# EAGLE design Kobold -- ATtiny85 and DRV8830 Combo -- v07 (EAGLE 6.5.0)
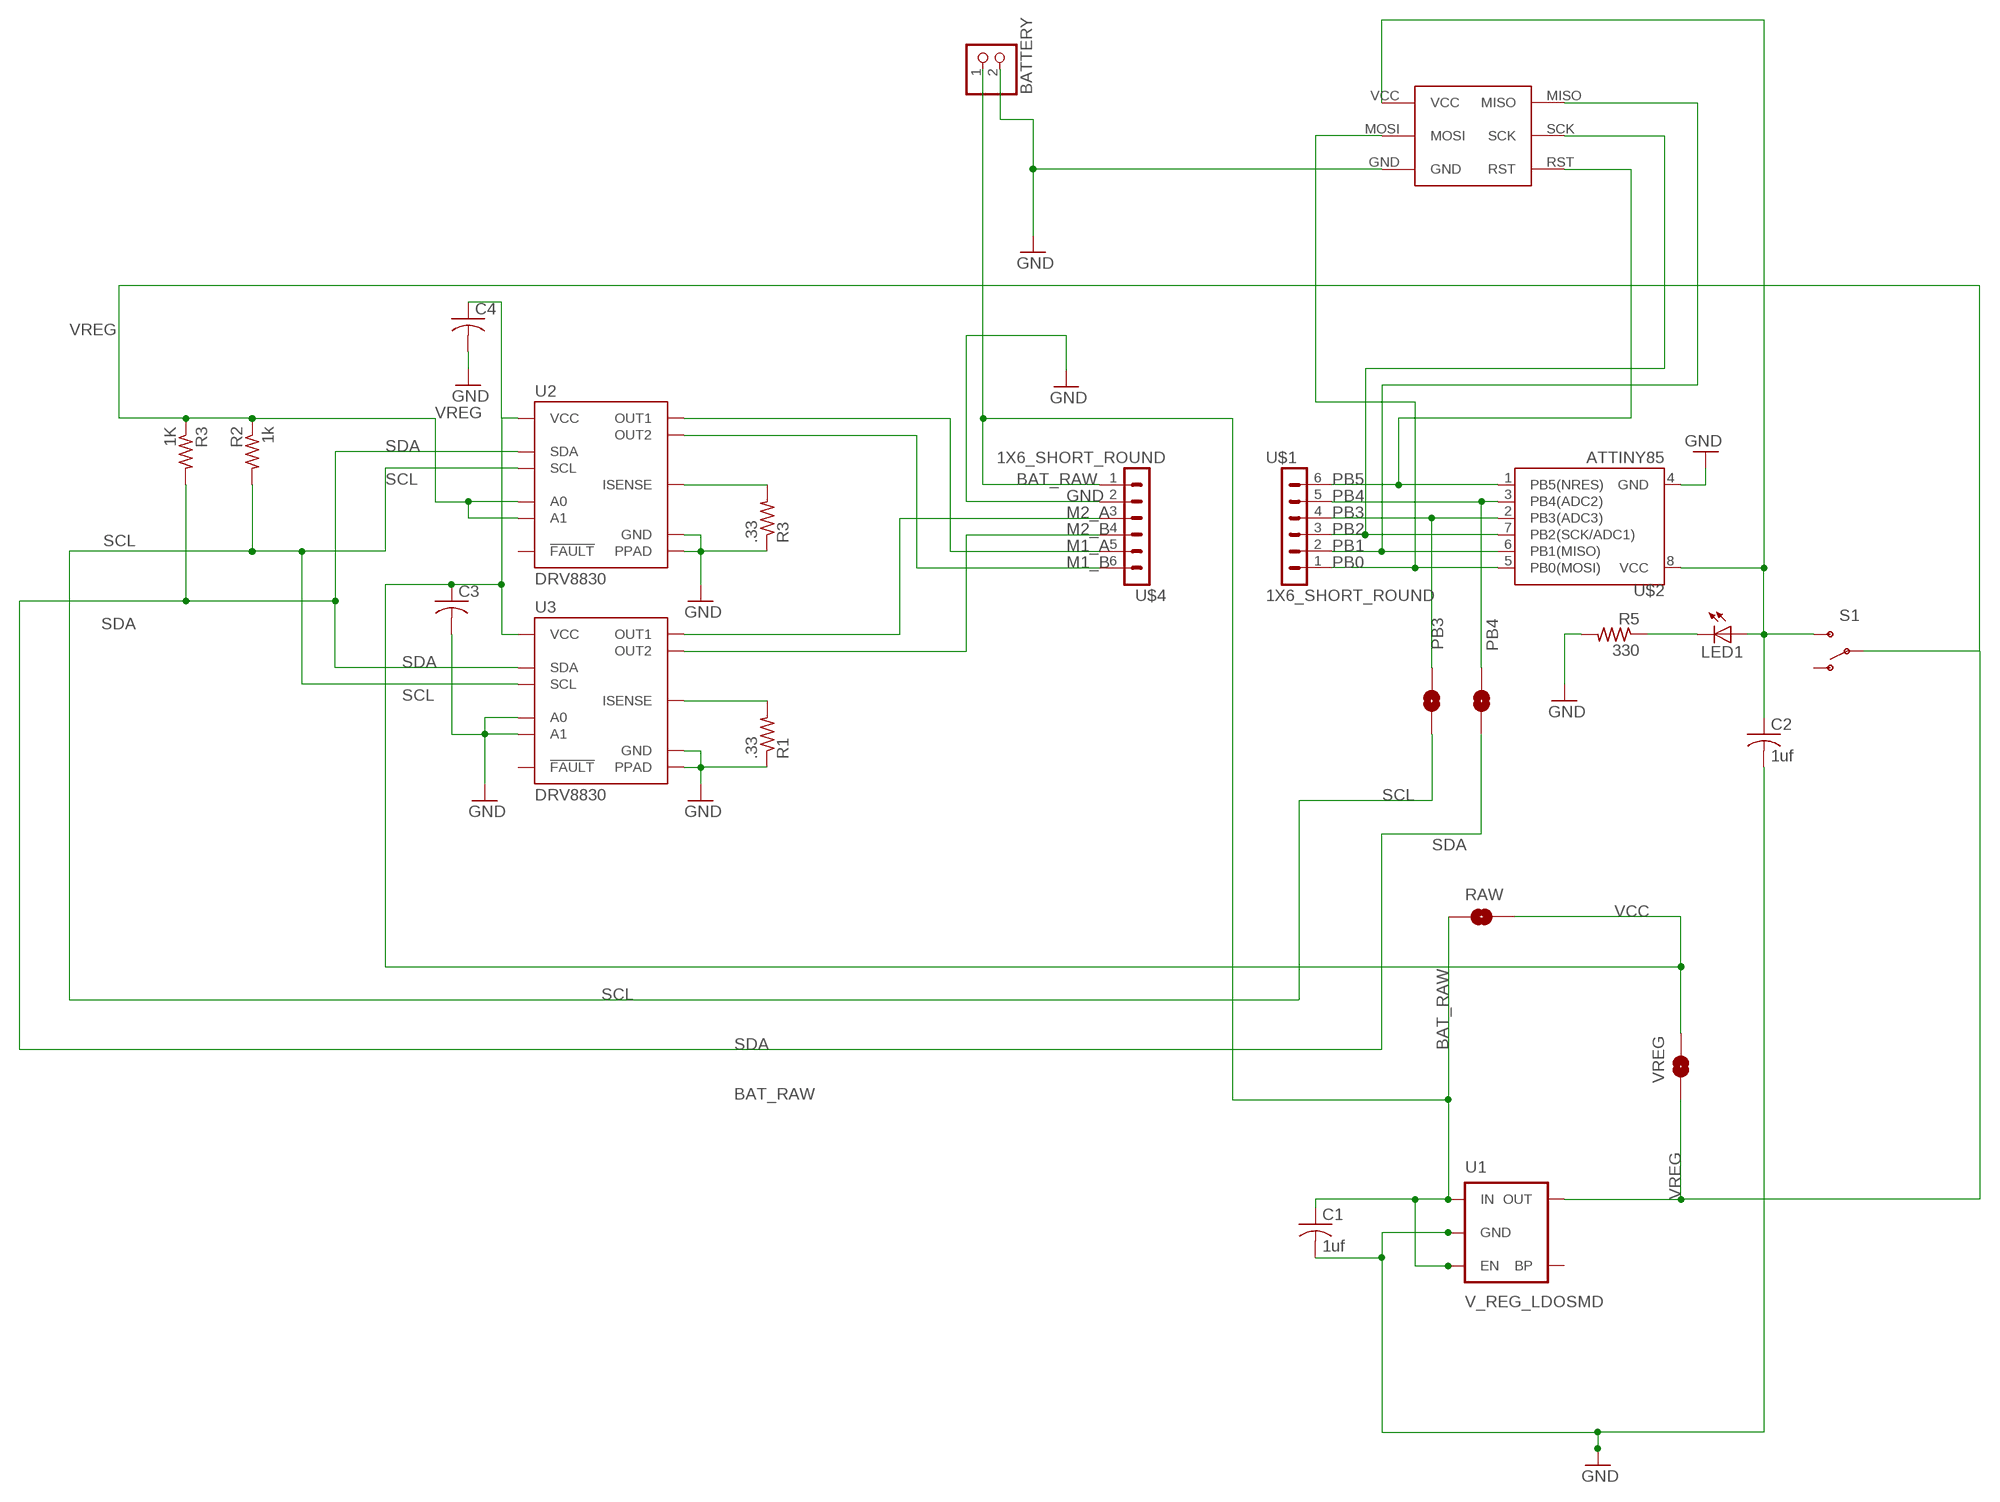
[diagram p0: schematic, sheet 1]

## Parts
1K  R3  R-US_R0402  [R0402]
BATTERY  JST_2PIN-THM  [JST-PH-2-THM]
C1  1uf  C-USC0402  [C0402]
C2  1uf  C-USC0402  [C0402]
C3  C-USC0402  [C0402]
C4  C-USC0402  [C0402]
LED1  LEDCHIP-LED0603  [CHIP-LED0603]
R1  .33  R-US_R0402  [R0402]
R2  1k  R-US_R0402  [R0402]
R3  .33  R-US_R0402  [R0402]
R5  330  R-US_R0402  [R0402]
RAW  SOLDERJUMPERNO  [SJ_2S-NO]
S1  SWITCH-SPDT-SMD-A  [SWITCH-SPST-SMD-A]
SJ6  SOLDERJUMPERNO  [SJ_2S-NO]
SJ7  SOLDERJUMPERNO  [SJ_2S-NO]
U1  V_REG_LDOSMD  [SOT23-5]
U2  DRV8830  [MSOP-10-GNDPAD]
U3  DRV8830  [MSOP-10-GNDPAD]
U$1  1X6_SHORT_ROUND  [1X6_SHORT_ROUND]
U$2  ATTINY85  ATTINY45  [SO08-EIAJ]
U$4  1X6_SHORT_ROUND  [1X6_SHORT_ROUND]
U$5  POGO_PIN_SPI_PAD  [POGO_PIN_SPI_PAD]
VREG  SOLDERJUMPERNO  [SJ_2S-NO]

## Nets
BAT_RAW: BATTERY.1 C1.1 RAW.1 U1.1(IN) U1.3(EN) U$4.1
GND: BATTERY.2 C1.2 C2.2 C3.2 C4.2 R1.1 R3.1 R5.2 U1.2(GND) U2.5(GND) U2.GND(PPAD) U3.5(GND) U3.7(A0) U3.8(A1) U3.GND(PPAD) U$2.4(GND) U$4.2 U$5.GND
M1_A: U2.3(OUT1) U$4.5
M1_B: U2.1(OUT2) U$4.6
M2_A: U3.3(OUT1) U$4.3
M2_B: U3.1(OUT2) U$4.4
N$1: R1.2 U3.2(ISENSE)
N$2: R3.2 U2.2(ISENSE)
N$3: LED1.C R5.1
PB0: U$1.1 U$2.5(PB0(MOSI)) U$5.MOSI
PB1: U$1.2 U$2.6(PB1(MISO)) U$5.MISO
PB2: U$1.3 U$2.7(PB2(SCK/ADC1)) U$5.SCK
PB3: SJ7.2 U$1.4 U$2.2(PB3(ADC3))
PB4: SJ6.2 U$1.5 U$2.3(PB4(ADC2))
PB5: U$1.6 U$2.1(PB5(NRES)) U$5.RST
PP_VCC: C2.1 LED1.A S1.3(S) U$2.8(VCC) U$5.VCC
SCL: R2.2 SJ7.1 U2.10(SCL) U3.10(SCL)
SDA: 1K.2 SJ6.1 U2.9(SDA) U3.9(SDA)
VCC: C3.1 C4.1 RAW.2 U2.4(VCC) U3.4(VCC) VREG.2
VREG: 1K.1 R2.1 S1.2(P) U1.5(OUT) U2.7(A0) U2.8(A1) VREG.1
Unconnected: S1.1(O) U1.4(BP) U2.6(!FAULT) U3.6(!FAULT)

## Library data of the parts
1K R1-R3 R5 = resistor:R-US_: RESISTOR, American symbol
BATTERY = adafruit:JST_2PIN: JST 2-Pin Connectors of various flavors SMT-RA (S2B-PH-SM4) 4UConnector #17311 SMT (B2B-PH-SM4) THM-RA (S2B-PH) THM (B2B-PH)
C1-C4 = resistor:C-US: CAPACITOR, American symbol
LED1 = led:LED: LED OSRAM: - CHIPLED LG R971, LG N971, LY N971, LG Q971, LY Q971, LO R971, LY R971 LH N974, LH R974 LS Q976, LO Q976, LY Q976 LO Q996 - Hyper CHIPLED LW Q18S LB Q993, LB Q99A, LB R99A - SideLED LS A670, LO A670, LY A670, LG A670, LP A670 LB A673, LV A673, LT A673, LW A673 LH A674 LY A675 LS A676, LA A676, LO A676, LY A676, LW A676 LS A679, LY A679, LG A679 - Hyper Micro SIDELED® LS Y876, LA Y876, LO Y876, LY Y876 LT Y87S - SmartLED LW L88C, LW L88S LB L89C, LB L89S, LG L890 LS L89K, LO L89K, LY L89K LS L896, LA L896, LO L896, LY L896 - TOPLED LS T670, LO T670, LY T670, LG T670, LP T670 LSG T670, LSP T670, LSY T670, LOP T670, LYG T670 LG T671, LOG T671, LSG T671 LB T673, LV T673, LT T673, LW T673 LH T674 LS T676, LA T676, LO T676, LY T676, LB T676, LH T676, LSB T676, LW T676 LB T67C, LV T67C, LT T67C, LS T67K, LO T67K, LY T67K, LW E67C LS E67B, LA E67B, LO E67B, LY E67B, LB E67C, LV E67C, LT E67C LW T67C LS T679, LY T679, LG T679 LS T770, LO T770, LY T770, LG T770, LP T770 LB T773, LV T773, LT T773, LW T773 LH T774 LS E675, LA E675, LY E675, LS T675 LS T776, LA T776, LO T776, LY T776, LB T776 LHGB T686 LT T68C, LB T68C - Hyper Mini TOPLED® LB M676 - Mini TOPLED Santana® LG M470 LS M47K, LO M47K, LY M47K Source: http://www.osram.convergy.de LUXEON: - LUMILED® LXK2-PW12-R00, LXK2-PW12-S00, LXK2-PW14-U00, LXK2-PW14-V00 LXK2-PM12-R00, LXK2-PM12-S00, LXK2-PM14-U00 LXK2-PE12-Q00, LXK2-PE12-R00, LXK2-PE12-S00, LXK2-PE14-T00, LXK2-PE14-U00 LXK2-PB12-K00, LXK2-PB12-L00, LXK2-PB12-M00, LXK2-PB14-N00, LXK2-PB14-P00, LXK2-PB14-Q00 LXK2-PR12-L00, LXK2-PR12-M00, LXK2-PR14-Q00, LXK2-PR14-R00 LXK2-PD12-Q00, LXK2-PD12-R00, LXK2-PD12-S00 LXK2-PH12-R00, LXK2-PH12-S00 LXK2-PL12-P00, LXK2-PL12-Q00, LXK2-PL12-R00 Source: www.luxeon.com KINGBRIGHT: KA-3528ASYC Source: www.kingbright.com
RAW SJ6 SJ7 VREG = SparkFun:SOLDERJUMPER: Solder Jumper Standard SMD solder jumper. Used to automate production. Two varients : Normally Open and Normally Closed are the same, but have different paste layers. NC will have a large amount of paste and should jumper during reflow.
S1 = SparkFun-Electromechanical:SWITCH-SPDT: SPDT Switch Simple slide switch, Spark Fun Electronics SKU : COM-00102 DPDT SMT slide switch, AYZ0202, SWCH-08179
U1 = SparkFun:V_REG_LDO: Voltage Regulator LDO Standard 150mA LDO voltage regulator in SOT-23 layout. Micrel part MIC5205. BP (by-pass) pin is used to lower output noise with 470pF cap.
U2 U3 = SparkFun-PowerIC:DRV8830: DRV8830 I2C DC Motor Driver TSSOP-10 with exposed power pad 1A current limit, 2.75V to 6.8V; PROD_ID: IC-11646
U$1 U$4 = Random parts(01-14-14):1X6_SHORT_ROUND
U$2 = SparkFun:ATTINY45: Atmel ATTiny45
U$5 = Random parts(01-14-14):POGO_PIN_SPI_PAD

## Board
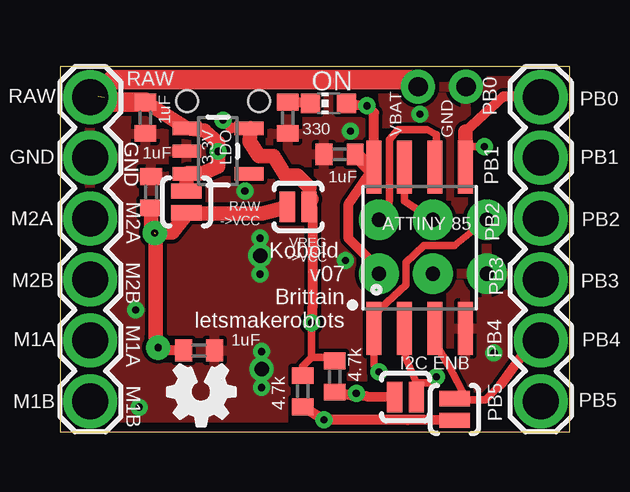
[diagram p1: board, top side]
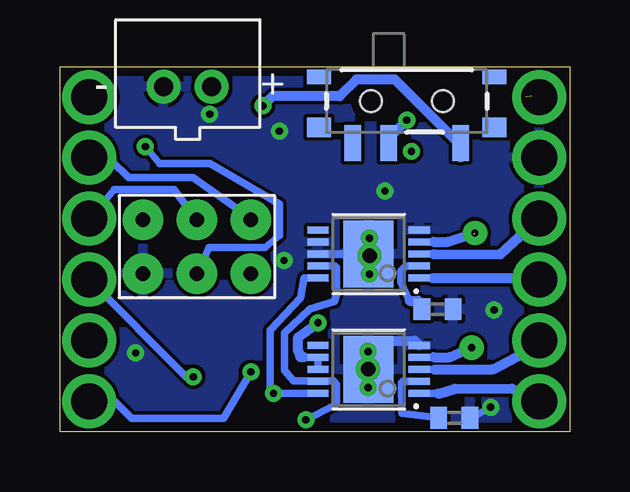
[diagram p2: board, bottom side, seen from below]

Size 21.26 x 15.23 mm. Coordinates in mm from the lower left corner, seen from the top.
Outline: 0,0 21.26,0 21.26,15.23 0,15.23 0,0
Copper layers (1*16): Top 0.035mm / dielectric 1.5mm / Bottom 0.035mm
Design rules "default *": minimum track width 10mil, minimum drill 24mil, track to track 6mil, track to pad 6mil, pad to pad 6mil, via to via 6mil, smd to smd 6mil, copper to edge 15mil, drill to drill 8mil, minimum pad ring 10mil, minimum via ring 8mil, stop-mask expansion 4mil, vias tented up to drill 0.3mm, thermal gap 6mil

### Footprints (pad centres in the part's own frame; a part is rotated, then mirrored left to right if it is on the bottom)
R0402 = smd 0.7 x 0.9: 1 -0.65,0; 2 0.65,0
JST-PH-2-THM = drill 0.8 pad 1.422: 1 1,0; 2 -1,0
C0402 = smd 0.7 x 0.9: 1 -0.65,0; 2 0.65,0
CHIP-LED0603 = smd 0.8 x 0.8: A 0,-0.75; C 0,0.75
SJ_2S-NO = smd 0.635 x 1.27: 1 -0.45,0; 2 0.45,0
SWITCH-SPST-SMD-A = smd 0.7 x 1.5: 1 -2.25,-1.75; 2 -0.75,-1.75; 3 2.25,-1.75 | smd 1 x 0.6: GND1 -3.65,1; GND3 3.65,1 | smd 1 x 0.8: GND2 -3.65,-1.1; GND4 3.65,-1.1 | hole 0.9: -1.5,0; 1.5,0
SOT23-5 = smd 0.55 x 1.2: 1 -0.95,-1.3; 2 0,-1.3; 3 0.95,-1.3; 4 0.95,1.3; 5 -0.95,1.3
MSOP-10-GNDPAD = smd 0.305 x 0.889: 1 -1,-2.11; 2 -0.5,-2.11; 3 0,-2.11; 4 0.5,-2.11; 5 1,-2.11; 6 1,2.11; 7 0.5,2.11; 8 0,2.11; 9 -0.5,2.11; 10 -1,2.11 | smd 2.794 x 2.083: GND 0,0
1X6_SHORT_ROUND = drill 1.5 pad 2.2: 1 1.27,-1.27; 2 3.81,-1.27; 3 6.35,-1.27; 4 8.89,-1.27; 5 11.43,-1.27; 6 13.97,-1.27
SO08-EIAJ = smd 0.61 x 2.21: 1 -1.905,-3.378; 2 -0.635,-3.378; 3 0.635,-3.378; 4 1.905,-3.378; 5 1.905,3.353; 6 0.635,3.353; 7 -0.635,3.353; 8 -1.905,3.353
POGO_PIN_SPI_PAD = drill 0.6 pad 1.676: GND 1,-1; MISO 3.25,-5.5; MOSI 1,-3.25; RST 3.25,-1; SCK 3.25,-3.25; VCC 1,-5.5

### Placement (x,y rotation side)
1K  10.12,1.7 270 top
BATTERY  15.93,14.39 0 bottom
C1  3.56,13.1 270 top
C2  11.66,11.58 180 top
C3  5.8,3.4 0 top
C4  3.8,10 90 top
LED1  11.2,13.7 90 top
R1  5.52,5.11 180 bottom
R2  11.46,2.31 270 top
R3  4.81,0.59 180 bottom
R5  9.5,13.1 270 top
RAW  5.28,9.59 270 top
S1  6.8,13.8 0 bottom
SJ6  16.45,0.94 90 top
SJ7  14.41,1.46 0 top
U1  6.59,11.71 270 top
U2  8.39,2.61 90 bottom
U3  8.39,7.42 90 bottom
U$1  21.31,15.24 270 top
U$2  15,7.69 0 top
U$4  2.54,15.24 270 top
U$5  18.8,5.6 90 bottom
U$6  [OSHW_FILLX100_NOTEXT]  7.3,2.8 180 top
VREG  9.93,9.39 180 top

### Tracks (layer width: path | path; a pad name or v marks a point on that pad's centre or on a via)
BAT_RAW  (via drill 0.3)  (1 unrouted)
  Top 0.305: 5.11,12.74 U1.1
  Top 0.406: U$4.1 1.83,13.97 | 5.33,10.8 U1.3 | RAW.1 | 6.58,12.07 6.58,11.62 v6.6,11.7 | 1.6,14 1.6,14.1
  Top 0.61: C1.1 U1.1 6.04,12.56 6.58,12.07 | 6.58,11.62 6.58,11.07 5.97,10.8 5.33,10.8 | U1.3 RAW.1 | 14.9,14.4 BATTERY.1
  Top 0.813: 1.83,13.97 2.05,13.75 3.53,13.75 C1.1 | 1.6,14.1 2.2,14.7 14.6,14.7 14.9,14.4
  Bottom 0.406: 6.55,11.85 v6.6,11.7
GND  (via drill 0.3, 0.6)
  Bottom 0.305: U3.8 U3.GND | R3.1 4.19,0.54 v3.3,1.03
  Bottom 0.406: U2.GND 8.39,3.41 8,3.8 6.47,3.8 U2.5
  other vias: 8.35,6.58 18.1,3.3 3.16,5.09 8.35,7.35 8.35,8.08 8.41,1.85 8.41,2.62 8.41,3.35 7.71,10.05 15.01,13.25 11.91,7.15 12.11,12.55
  pour Bottom: 0,0 0,15.24 21.59,15.24 21.59,0
  pour Top: 0,0 0,15.24 21.59,15.24 21.59,0
M1_A
  Bottom 0.305: U2.3 5.63,2.61 5.63,2.6
  Bottom 0.406: 5.63,2.6 3.19,2.61 1.5,3.5 U$4.5
M1_B
  Bottom 0.305: U2.1 5.51,1.61 5.5,1.59
  Bottom 0.406: 5.5,1.59 4.8,1.8 2.41,1.81 U$4.6
M2_A
  Bottom 0.305: U3.3 5.68,7.42
  Bottom 0.406: 5.68,7.42 2.89,7.4 U$4.3
M2_B
  Bottom 0.305: U3.1 5.71,6.42
  Bottom 0.406: 5.71,6.42 1.54,6.42 U$4.4
N$1
  Bottom 0.305: U3.2 6.83,6.92 7.04,6.71 7.04,6.22 6.68,5.46 | R1.2 6.19,5.13 6.32,5.46
  Bottom 0.406: 6.68,5.46 6.32,5.46
N$2
  Bottom 0.305: U2.2 6.95,2.11 7.03,2.04 7.01,0.76 R3.2
N$3
  Top 0.406: R5.1 10.2,13.75 LED1.C
PB0  (via drill 0.3)
  Top 0.305: v17.7,11.9 17.01,11.9 16.91,11.8
  Top 0.406: 16.91,12.53 18.5,14 20.01,14 U$1.1
  Top 0.61: U$2.5 16.91,11.8 16.91,12.53
  Bottom 0.305: 15.6,6.5 U$5.MOSI 15.05,7.7 12.7,7.7 12.1,8.2 12.1,9.5 15,11.2 17.1,11.2 17.6,11.8 v17.7,11.9
PB1
  Top 0.305: U$5.MISO 13.7,9.1 13.73,9.75 13.73,12.18 14.08,12.6 15.3,12.6 15.7,12.4 15.7,11.1 U$2.6
  Top 0.406: 15.71,10.69 U$2.6
  Bottom 0.305: 13,8.7 U$5.MISO 13.3,8.9 15.7,10.6 18.4,10.6 19.1,11.3 20,11.3 20,11.39 U$1.2
PB2
  Top 0.305: U$2.7 14.37,9.63 U$5.SCK
  Bottom 0.305: U$1.3 20.01,8.89 19,10.1 16.5,10.1 15.6,8.9 U$5.SCK
PB3  (via drill 0.3)
  Top 0.305: SJ7.2 14.86,2.04 | 14.86,2.04 14.4,3.1 14.4,4.27 U$2.2 | 14.86,2.04 15.44,2.04 v15.7,2.3
  Bottom 0.305: v15.7,2.3 15.99,2.3 U$1.4
PB4
  Top 0.305: SJ6.2 16.97,1.33 | 16.97,1.33 16.2,2.8 15.7,3.6 15.7,4.24 U$2.3 | 16.97,1.33 17.73,1.33 18.4,2
  Top 0.406: U$1.5 19.71,3.81 18.4,2
PB5  (via drill 0.3)
  Top 0.305: v13.3,2.5 13.3,2.6 13.1,2.8 U$2.1 13.1,4.89 14.42,6.12 14.42,7.06 15.18,7.77 16.44,7.76 U$5.RST
  Bottom 0.305: U$1.6 18.98,1.27 18.27,0.57 14.43,0.57 v13.3,2.5
PP_VCC  (via drill 0.3)
  Top 0.406: U$5.VCC 13.3,6.8 12.04,8.06 12.04,9.5 U$2.8 13.1,13.3 v12.8,13.6 LED1.A
  Top 0.61: U$2.8 12.85,11.04 C2.1
  Bottom 0.406: S1.3 4.55,11.95 | 4.55,11.45 4.55,11.95 | 4.55,11.95 7.3,14.7 8.9,14.7 9.6,14 12.4,14 v12.8,13.6
SCL  (via drill 0.3)
  Top 0.305: 12.21,1.5 12.41,1.45 v12.36,1.6
  Top 0.406: SJ7.1 12.78,1.49 12.21,1.5 R2.2
  Bottom 0.305: U3.10 11.08,6.41 11.23,5.58 12.5,4.24 12.5,2.5 | 12.5,2.5 12.5,2.56 | U2.10 10.42,1.61 11.06,1.6 11.15,1.61 11.86,1.61 v12.36,1.6 12.5,1.85 12.5,2.5
SDA  (via drill 0.3)
  Top 0.406: SJ6.1 15.16,0.51 14.5,0.5 v11.01,0.5 1K.2
  Bottom 0.305: U3.9 9.79,6.92 9.72,6.85 9.72,5.74 9.81,5.45 10.83,5.13 11.89,4.13 11.9,2.57 11.52,2.12 11.04,2.12 11.07,2.12 U2.9 10.49,2.12 9.85,2.12 9.74,1.99 9.74,1.17 9.81,1.1 v11.01,0.5
VCC  (via drill 0.3 pad 1.02)  (1 unrouted)
  Top 0.406: C3.1 4.21,3.4 v4.1,3.52
  Top 0.61: v4.1,3.52 4.14,3.48 3.99,3.93 4,8.25 3.8,8.55 C4.1 | VREG.2 8.43,9.11 5.31,9.11 | 5.31,9.11 RAW.2 | 5.31,9.11 4.67,8.31 v3.95,8.29
  Bottom 0.305: U3.4 5.68,7.92 | 5.68,7.92 | U2.4 5.67,3.11
  Bottom 0.406: 5.68,7.92 5.09,7.92 v3.95,8.29 | 5.67,3.11 5.01,3.11 v4.1,3.52
VREG  (via drill 0.3)
  Top 0.305: v10.49,4.55 10.49,3.19 10.5,3.19 U2.7 | 7.93,12.81 U1.5 7.94,12.66 | 1K.1 10.12,2.73 U2.7 | 11.4,3.1 U2.7
  Top 0.406: 10.05,2.33 1K.1 | R2.1 11.46,2.84 11.4,3.1 | v10.49,4.55 10.49,4.69 10.53,4.94 10.53,5.17 10.53,9.39 VREG.1 10.4,9.4 10.4,10.2 | U1.5 7.14,12.66 v6.8,13
  Top 0.61: VREG.1 10.48,9.7 | 7.94,12.66 7.9,12.1 8.3,11.5 8.9,11.5 9.4,10.7 9.9,10.7 10.4,10.2
  Bottom 0.305: U2.8 U2.7 11.08,3.12 11.09,3.11
  Bottom 0.406: 11.09,3.11 11.23,3.11 11.34,3.42 11.32,3.94 v10.49,4.55 | S1.2 7.55,12.25 v6.8,13

### Text on the board
_tsilk: RAW | RAW | ON | VBAT | GND | PB0 | 1uF | 3.3V / LDO | PB0 | GND | GND | 330 | PB1 | GND | 1uF | 1uF | M2A | RAW / ->VCC | PB1 | M2A | ATTINY 85 | PB2 | VREG / ->VCC | Kobold / v07 / Brittain / letsmakerobots | PB2 | M2B | PB3 | M2B | PB3 | PB4 | M1A | M1A | 1uF | PB4 | I2C ENB | M1B | 4.7k | PB5 | M1B | 4.7k | PB5
_bsilk: PB2 | MISO | SCK | RES | DRV8830 | .33 Ohm | DRV8830 | VIN | MOSI | GND | PB3 | .33 Ohm